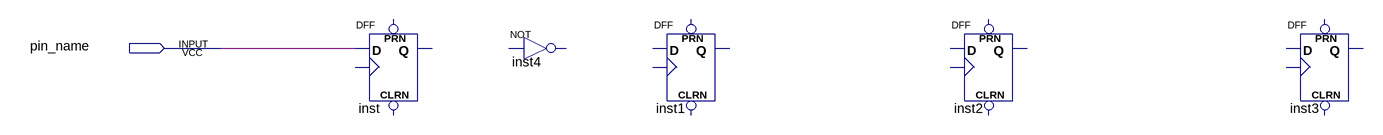
[diagram p0: schematic sheet]
// Quartus schematic counter_with_set_16.bdf as structural Verilog: 5 symbols, 1 pins
module counter_with_set_16 (
  input  pin_name
);

  DFF inst (.D(pin_name));  // open: CLRN, CLK, PRN, Q
  // NOT inst4 is placed but not wired
  DFF inst1 ();  // open: CLRN, CLK, D, PRN, Q
  DFF inst2 ();  // open: CLRN, CLK, D, PRN, Q
  DFF inst3 ();  // open: CLRN, CLK, D, PRN, Q
endmodule
